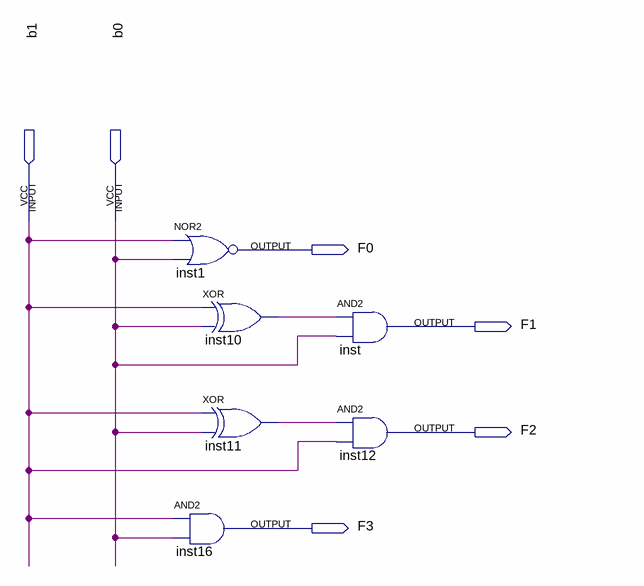
[diagram p0: schematic sheet]
// Quartus schematic ex1-3.bdf as structural Verilog: 6 symbols, 6 pins
module \ex1-3  (
  input  b1,
  input  b0,
  output F0,
  output F1,
  output F2,
  output F3
);

  wire inst10_out, inst11_out;

  nor inst1 (F0, b1, b0);
  and inst16 (F3, b1, b0);
  xor inst10 (inst10_out, b1, b0);
  xor inst11 (inst11_out, b1, b0);
  and inst (F1, inst10_out, b0);
  and inst12 (F2, inst11_out, b1);
endmodule
